# Altium schematic sheet RGMII_PHY.SchDoc
size A3; Organization: Altium Limited; Address1: L3, 12a Rodborough Rd; Address2: Frenchs Forest; Address3: NSW; Address4: Australia 2086; DocumentNumber: 25; SheetNumber: 25; SheetTotal: 54
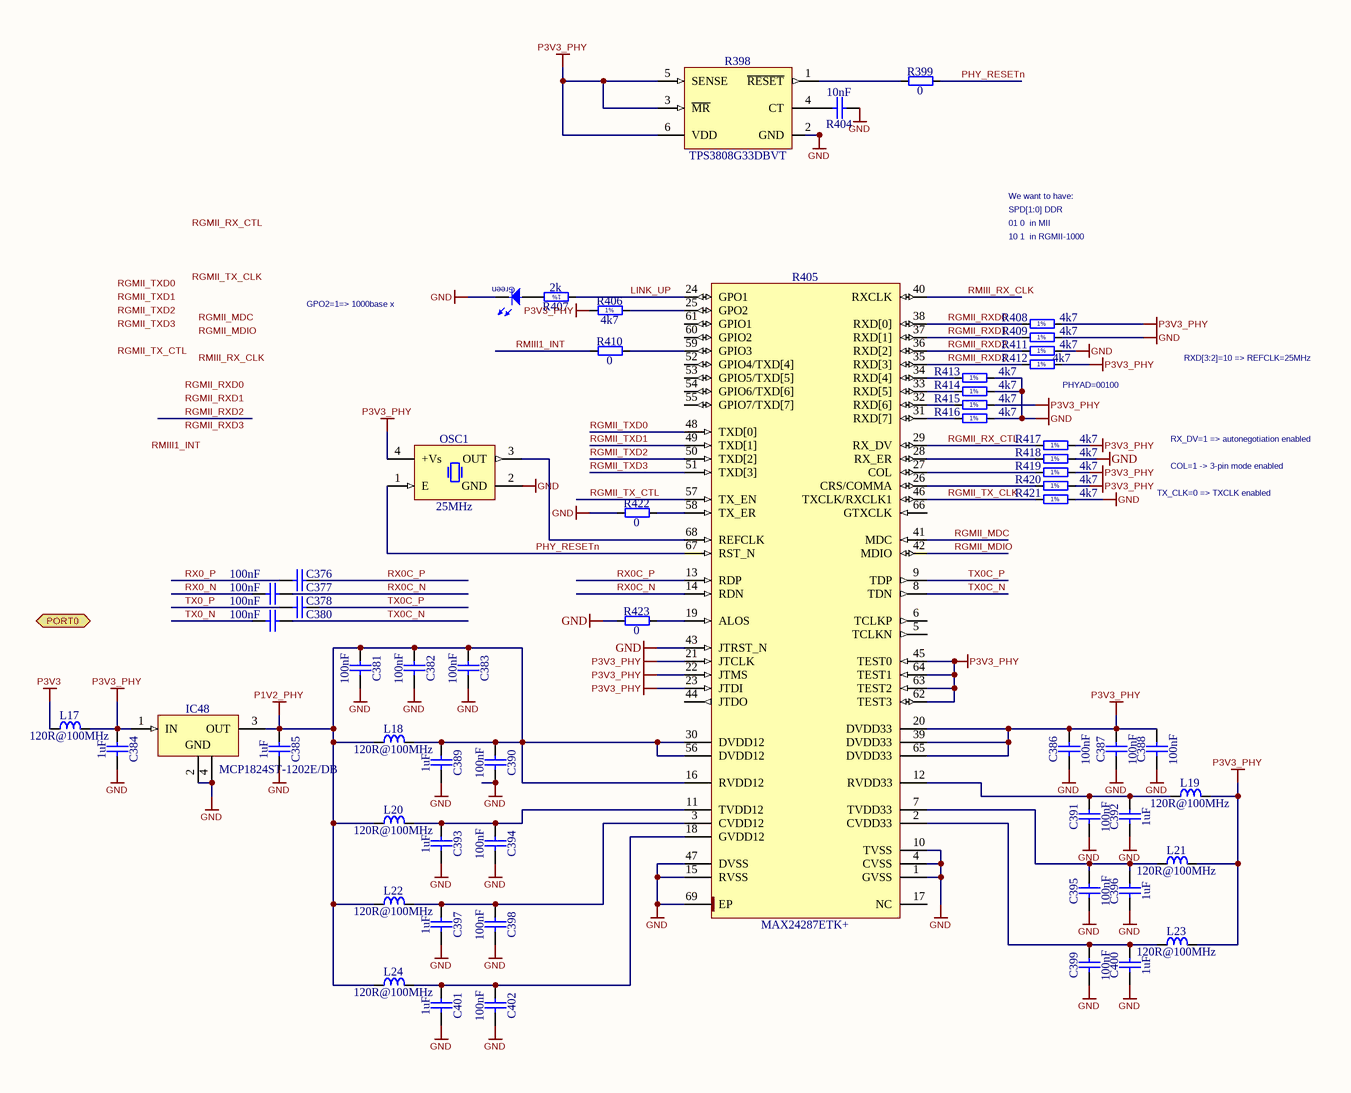
[diagram p0: RGMII_PHY.SchDoc]

## Parts
C376  100nF  [CAPC0603X33N]
C377  100nF  [CAPC0603X33N]
C378  100nF  [CAPC0603X33N]
C380  100nF  [CAPC0603X33N]
C381  100nF  [CAPC0603X33N]
C382  100nF  [CAPC0603X33N]
C383  100nF  [CAPC0603X33N]
C384  1uF  [CAPC1005X55N]
C385  1uF  [CAPC1005X55N]
C386  100nF  [CAPC0603X33N]
C387  100nF  [CAPC0603X33N]
C388  100nF  [CAPC0603X33N]
C389  1uF  [CAPC1005X55N]
C390  100nF  [CAPC0603X33N]
C391  100nF  [CAPC0603X33N]
C392  1uF  [CAPC1005X55N]
C393  1uF  [CAPC1005X55N]
C394  100nF  [CAPC0603X33N]
C395  100nF  [CAPC0603X33N]
C396  1uF  [CAPC1005X55N]
C397  1uF  [CAPC1005X55N]
C398  100nF  [CAPC0603X33N]
C399  100nF  [CAPC0603X33N]
C400  1uF  [CAPC1005X55N]
C401  1uF  [CAPC1005X55N]
C402  100nF  [CAPC0603X33N]
IC48  MCP1824ST-1202E/DB  [SOT230P700X180-4N]
L17  120R@100MHz  [INDC1005X55N]
L18  120R@100MHz  [INDC1005X55N]
L19  120R@100MHz  [INDC1005X55N]
L20  120R@100MHz  [INDC1005X55N]
L21  120R@100MHz  [INDC1005X55N]
L22  120R@100MHz  [INDC1005X55N]
L23  120R@100MHz  [INDC1005X55N]
L24  120R@100MHz  [INDC1005X55N]
LED1  Green  (value not drawn)
OSC1  25MHz  [OSC_IQD_CFPS-73]
R398  TPS3808G33DBVT  [SOT95P280X145-6N]
R399  0  [RESC1005X40N]
R404  10nF  [CAPC1005X55N]
R405  MAX24287ETK+  [QFN40P800X800X80-69N-S635]
R406  4k7  [RESC1005X40N]
R407  2k  [RESC1005X40N]
R408  4k7  [RESC1005X40N]
R409  4k7  [RESC1005X40N]
R410  0  [RESC1005X40N]
R411  4k7  [RESC1005X40N]
R412  4k7  [RESC1005X40N]
R413  4k7  [RESC1005X40N]
R414  4k7  [RESC1005X40N]
R415  4k7  [RESC1005X40N]
R416  4k7  [RESC1005X40N]
R417  4k7  [RESC1005X40N]
R418  4k7  [RESC1005X40N]
R419  4k7  [RESC1005X40N]
R420  4k7  [RESC1005X40N]
R421  4k7  [RESC1005X40N]
R422  0  [RESC1005X40N]
R423  0  [RESC1005X40N]

## Ports
PORT0 (bidir)

## Nets
GND: C381.1 C382.1 C383.1 C384.1 C385.1 C386.1 C387.1 C388.1 C389.1 C390.1 C391.1 C392.1 C393.1 C394.1 C395.1 C396.1 C397.1 C398.1 C399.1 C400.1 C401.1 C402.1 IC48.2(GND) IC48.4(GND) LED1.1(C) OSC1.2(GND) R398.2(GND) R404.1 R405.1(GVSS) R405.4(CVSS) R405.10(TVSS) R405.15(RVSS) R405.43(JTRST_N) R405.47(DVSS) R405.69(EP) R409.2 R411.2 R413.2 R414.2 R416.2 R418.2 R421.2 R422.1 R423.1
P1V2_PHY: C381.2 C382.2 C383.2 C385.2 C389.2 C390.2 IC48.3(OUT) L18.1 L18.2 L20.2 L22.2 L24.2 R405.16(RVDD12) R405.30(DVDD12) R405.56(DVDD12)
P3V3: L17.1
P3V3_PHY: C384.2 C386.2 C387.2 C388.2 IC48.1(IN) L17.2 L19.2 L21.2 L23.2 OSC1.4(+Vs) R398.3(~{MR}) R398.5(SENSE) R398.6(VDD) R405.20(DVDD33) R405.21(JTCLK) R405.22(JTMS) R405.23(JTDI) R405.39(DVDD33) R405.45(TEST0) R405.62(TEST3) R405.63(TEST2) R405.64(TEST1) R405.65(DVDD33) R406.1 R408.2 R412.2 R415.2 R417.2 R419.2 R420.2
LINK_UP: R405.24(GPO1) R407.1
PHY_RESETn: OSC1.1(E) R399.2 R405.67(RST_N)
RGMII_MDC: R405.41(MDC)
RGMII_MDIO: R405.42(MDIO)
RGMII_RX_CTL: R405.29(RX_DV) R417.1
RGMII_RXD0: R405.38(RXD[0]) R408.1
RGMII_RXD1: R405.37(RXD[1]) R409.1
RGMII_RXD2: R405.36(RXD[2]) R411.1
RGMII_RXD3: R405.35(RXD[3]) R412.1
RGMII_TX_CLK: R405.46(TXCLK/RXCLK1) R421.1
RGMII_TX_CTL: R405.57(TX_EN)
RGMII_TXD0: R405.48(TXD[0])
RGMII_TXD1: R405.49(TXD[1])
RGMII_TXD2: R405.50(TXD[2])
RGMII_TXD3: R405.51(TXD[3])
RMIII1_INT: R410.1
RMIII_RX_CLK: R405.40(RXCLK)
RX0_N: C377.1
RX0_P: C376.1
RX0C_N: C377.2 R405.14(RDN)
RX0C_P: C376.2 R405.13(RDP)
TX0_N: C380.1
TX0_P: C378.1
TX0C_N: C380.2 R405.8(TDN)
TX0C_P: C378.2 R405.9(TDP)
NetC391_2: C391.2 C392.2 L19.1 R405.12(RVDD33)
NetC393_2: C393.2 C394.2 L20.1 R405.11(TVDD12)
NetC395_2: C395.2 C396.2 L21.1 R405.7(TVDD33)
NetC397_2: C397.2 C398.2 L22.1 R405.3(CVDD12)
NetC399_2: C399.2 C400.2 L23.1 R405.2(CVDD33)
NetC401_2: C401.2 C402.2 L24.1 R405.18(GVDD12)
NetLED1_2: LED1.2(A) R407.2
NetOSC1_3: OSC1.3(OUT) R405.68(REFCLK)
NetR398_1: R398.1(~{RESET}) R399.1
NetR398_4: R398.4(CT) R404.2
NetR405_19: R405.19(ALOS) R423.2
NetR405_25: R405.25(GPO2) R406.2
NetR405_26: R405.26(CRS/COMMA) R420.1
NetR405_27: R405.27(COL) R419.1
NetR405_28: R405.28(RX_ER) R418.1
NetR405_31: R405.31(RXD[7]) R416.1
NetR405_32: R405.32(RXD[6]) R415.1
NetR405_33: R405.33(RXD[5]) R414.1
NetR405_34: R405.34(RXD[4]) R413.1
NetR405_58: R405.58(TX_ER) R422.2
NetR405_59: R405.59(GPIO3) R410.2

Not connected (* = marked no-connect by the designer): R405 5(TCLKN) 6(TCLKP) 17(NC) 44(JTDO) 52(GPIO4/TXD[4]) 53(GPIO5/TXD[5]) 54(GPIO6/TXD[6]) 55(GPIO7/TXD[7]) 60(GPIO2) 61(GPIO1) 66(GTXCLK)

## Notes on the sheet
- SPD[1:0] DDR
- We want to have:
- 01 0  in MII
- 10 1  in RGMII-1000
- GPO2=1=> 1000base x
- RXD[3:2]=10 => REFCLK=25MHz
- PHYAD=00100
- RX_DV=1 => autonegotiation enabled
- TX_CLK=0 => TXCLK enabled
- COL=1 -> 3-pin mode enabled
- Labels drawn without touching a wire or pin: RGMII_MDC, RGMII_MDIO, RGMII_RX_CTL, RGMII_RXD0, RGMII_RXD1, RGMII_RXD3, RGMII_TX_CLK, RGMII_TX_CTL, RGMII_TXD0, RGMII_TXD1, RGMII_TXD2, RGMII_TXD3, RMIII1_INT, RMIII_RX_CLK
- Title
- Size:
- Date:
- A3
- Number:
- Time:
- Revision:
- Sheet
- of
- File:
- (in symbol R0402_2K_1%_0.0625W_100PPM) 1%
- (in symbol R0402_4K7_1%_0.0625W_100PPM) 1%

## Library data of the parts
C376-C378 C380-C383 C386-C388 C390 C391 C394 C395 C398 C399 C402 = CC0201_100NF_6.3V_10%_X5R: Non-polarised capacitor; Manufacturer: GENERIC; Part Description: SMD Multilayer Chip Ceramic Capacitor; Manufacturer1 Part Number: 02016D104KAT2A; Tolerance: ±10%; Voltage: 6.3V; TC: X5R; Manufacturer Part Number: CC0201_100NF_6.3V_10%_X5R; Part Number: CC0201_100NF_6.3V_10%_X5R; Value: 100nF; Component Kind: Standard; Component Type: Standard; Pin Count: 2; Status: Not Recommended; Case: 0201; Mounted: Yes; Socket: No; SMD: Yes; Sense: No; Manufacturer1 Example: AVX; Manufacturer1 ComponentHeight: 0.33mm; HelpURL: \\cern.ch\dfs\Applications\Altium\Datasheets\CC0201_X5R_AVX.pdf; Author: CERN DEM JLC; CreateDate: 03/12/2007; LatestRevisionDate: 03/12/2007
C384 C385 C389 C392 C393 C396 C397 C400 C401 = CC0402_1UF_16V_10%_X5R: Non-polarised capacitor; Manufacturer: GENERIC; Part Description: SMD Multilayer Chip Ceramic Capacitor; Manufacturer1 Part Number: C1005X5R1C105KT; Tolerance: ±10%; Voltage: 16V; TC: X5R; Manufacturer Part Number: CC0402_1UF_16V_10%_X5R; Part Number: CC0402_1UF_16V_10%_X5R; Value: 1uF; Component Kind: Standard; Component Type: Standard; Pin Count: 2; Status: Preferred; Case: 0402; Mounted: Yes; Socket: No; SMD: Yes; Sense: No; Manufacturer1 Example: TDK; Manufacturer1 ComponentHeight: 0.55mm; HelpURL: \\cern.ch\dfs\Applications\Altium\Datasheets\CC0402_X5R_TDK_C.pdf; Author: CERN DEM JLC; CreateDate: 25/10/2012; LatestRevisionDate: 25/10/2012
IC48 = MCP1824ST-1202E/DB: 3-Terminal Regulator 1=IN 2=GND 3=OUT 4=GND; Manufacturer: MICROCHIP TECHNOLOGY; Part Description: 1.2V 300mA, Low Voltage, Low Quiescent Current LDO Regulator; PressFit: No; Bonding: No; Manufacturer Part Number: MCP1824ST-1202E/DB; PackageDescription: SOT223, 2.30mm pitch; 3 pin, 3.70mm W X 6.70mm L, IPC Medium Density; Part Number: MCP1824ST-1202E/DB; Component Kind: Standard; Component Type: Standard; Device: MCP1824ST-1202E/DB; Pin Count: 4; Case: SOT223; Mounted: Yes; Socket: No; SMD: Yes; Sense: No; ComponentHeight: 1.8mm; HelpURL: \\cern.ch\dfs\Applications\Altium\Datasheets\MCP1824ST-1202E-DB.pdf; Author: CERN DEM JLC; CreateDate: 22/05/2012; LatestRevisionDate: 22/05/2012
L17-L24 = IND0402_MURATA_BLM15PX121SN1D: Inductor; Manufacturer: MURATA; Part Description: SMD EMIFIL Chip Ferrite Bead; Tolerance: ±25%; Power: 2A; Resistance: 0.055R; Manufacturer Part Number: BLM15PX121SN1D; Part Number: IND0402_MURATA_BLM15PX121SN1D; Value: 120R@100MHz; Component Kind: Standard; Component Type: Standard; Pin Count: 2; Status: None; Case: 0402; Mounted: Yes; Socket: No; SMD: Yes; Sense: No; ComponentHeight: 0.55mm; HelpURL: \\cern.ch\dfs\Applications\Altium\Datasheets\IND0402_MURATA_BLM15PX.pdf; Author: CERN DEM JMW; CreateDate: 19/02/2014; LatestRevisionDate: 19/02/2014
LED1 = (no symbol name): Manufacturer Part Number: LG L29K-G2J1-24-Z; Manufacturer: OSRAM; Part Description: Surface Mount Green LED (0603 Case); Part Name: LED_OSRAM_LG L29K-G2J1-24-Z; $$Internal_Resolution: 00001mm; $$NotCommonProperty_Bonding: No; $$NotCommonProperty_Case: 0603; $$NotCommonProperty_Footprint Ref: LED_OSRAM_LGL29K; $$NotCommonProperty_Mounted: Yes; $$NotCommonProperty_Pin Count: 2; $$NotCommonProperty_PressFit: No; CmpIndex: 57; DXDB_LIBNAME: LED_Displays; PressFit: No; Ref Designator: LED?; SymIndex: 383; Table: LEDs & Displays; $$NotCommonProperty_Color: Green; $$NotCommonProperty_ComponentHeight: 0.67mm; $$NotCommonProperty_Sense: No; $$NotCommonProperty_SMD: Yes; $$NotCommonProperty_Socket: No; Author: CERN DEM JLC; Bonding: No; Case: 0603; Cell Name: LED_OSRAM_LGL29K; Color: Green; Component Kind: Standard; Component Type: Standard; ComponentHeight: 0.67mm; CreateDate: 2012-04-24; Footprint: LED_OSRAM_LGL29K; HelpURL: \\cern.ch\dfs\Applications\Altium\Datasheets\LED_OSRAM_LGL29K.pdf; LatestRevisionDate: 2012-04-24; Mounted: Yes; PackageDescription: Green Chip LED, 2-Leads, Body 1.7x0.8mm, IPC Medium Density; Part Number: LED_OSRAM_LG L29K-G2J1-24-Z; Pin Count: 2; SMD: Yes; Socket: No; Orientation: 2 = 2; Comment_1: LED_OSRAM_LG L29K-G2J1-24-Z
OSC1 = OSC_25MHZ_IQD_LFSPXO018077: Oscillator 4 pins 1=E 2=GND 3=OUT 4=+Vs; Part Description: 3.3V, ±50ppm, 50pF, 0..70°C, HCMOS Surface Mount Clock Oscillator (CFPS-73 Series); Manufacturer: IQD FREQUENCY PRODUCTS; PressFit: No; Bonding: No; Part Number: OSC_25MHZ_IQD_LFSPXO018077; Component Kind: Standard; Component Type: Standard; PackageDescription: Oscillator, Side Concave, 5.08mm Pitch, 4 Pins, 5.00mm L X 7.00mm W X 1.40mm H, CFPS-73 Series; Value: 25MHz; Manufacturer Part Number: LFSPXO018077; Pin Count: 4; Mounted: Yes; Socket: No; SMD: Yes; Sense: No; ComponentHeight: 1.4mm; HelpURL: \\cern.ch\dfs\Applications\Altium\Datasheets\OSC_IQD_LFSPXO018077.pdf; Author: CERN DEM JLC; CreateDate: 14/04/2015; LatestRevisionDate: 03/11/2016
R398 = TPS3808G33DBVT: Low Quiescent Current, Programmable-Delay Supervisory Circuit; Manufacturer: TEXAS INSTRUMENTS; Part Description: 3.3V, Low Quiescent Current, Programmable-Delay Supervisory Circuit; PressFit: No; Bonding: No; Manufacturer Part Number: TPS3808G33DBVT; PackageDescription: SOT23, 6-Leads, Body 1.6x3.0mm, Pitch 0.95mm, IPC Medium Density; Part Number: TPS3808G33DBVT; Component Kind: Standard; Component Type: Standard; Device: TPS3808G33DBVT; Pin Count: 6; Case: SOT23-6; Mounted: Yes; Socket: No; SMD: Yes; Sense: No; ComponentHeight: 1.45mm; Author: CERN DEM JLC; HelpURL: \\cern.ch\dfs\Applications\Altium\Datasheets\TPS3808G33DBVT.pdf; CreateDate: 05/11/2013; LatestRevisionDate: 05/11/2013
R399 R410 R422 R423 = R0402_0R_JUMPER: Resistor; Manufacturer: GENERIC; Part Description: 1A (0.05R Max DC Resistance) Zero Ohm Jumper; Manufacturer1 Part Number: 232270591001L; PressFit: No; Manufacturer Part Number: R0402_0R_JUMPER; Part Number: R0402_0R_JUMPER; Value: 0; Component Kind: Standard; Component Type: Standard; Pin Count: 2; Status: Not Recommended; Case: 0402; Mounted: Yes; Sense: No; Socket: No; SMD: Yes; Manufacturer1 Example: YAGEO PHYCOMP; Manufacturer1 ComponentHeight: 0.4mm; HelpURL: \\cern.ch\dfs\Applications\Altium\Datasheets\R0402_Phycomp_RC0402.pdf; Author: CERN DEM JLC; CreateDate: 03/12/2007; LatestRevisionDate: 17/10/2012
R404 = CC0402_10NF_16V_10%_X7R: Non-polarised capacitor; Manufacturer: GENERIC; Part Description: SMD Multilayer Chip Ceramic Capacitor; Manufacturer1 Part Number: 223878715636; Tolerance: ±10%; Voltage: 16V; TC: X7R; Manufacturer Part Number: CC0402_10NF_16V_10%_X7R; Part Number: CC0402_10NF_16V_10%_X7R; Value: 10nF; Component Kind: Standard; Component Type: Standard; Pin Count: 2; Status: Not Recommended; Case: 0402; Mounted: Yes; Socket: No; SMD: Yes; Sense: No; Manufacturer1 Example: PHYCOMP; Manufacturer1 ComponentHeight: 0.55mm; HelpURL: \\cern.ch\dfs\Applications\Altium\Datasheets\CC0402_X7R_PHYCOMP.pdf; Author: CERN DEM JLC; CreateDate: 03/12/2007; LatestRevisionDate: 03/12/2007
R405 = MAX24287ETK+: 1Gbps Parallel-to-Serial MII Converter; Manufacturer: MAXIM; PressFit: No; Bonding: No; Manufacturer Part Number: MAX24287ETK+; PackageDescription: QFN, 0.40mm Pitch, Square; 68 Pin, 8.00mm L X 8.00mm W X 0.80mm H Body (W/Thermal Tab 6.35mm X 6.35mm), IPC Medium Density; Part Description: 1Gbps Parallel-to-Serial MII Converter; Part Number: MAX24287ETK+; Component Kind: Standard; Component Type: Standard; Device: MAX24287ETK+; Status: Not Recommended; Pin Count: 65; Case: QFN64; Mounted: Yes; Socket: No; SMD: Yes; Sense: No; ComponentHeight: 0.8mm; Author: CERN DEM BC; HelpURL: \\cern.ch\dfs\Applications\Altium\Datasheets\MAX24287ETK+.pdf; CreateDate: 16/08/2016; LatestRevisionDate: 30/03/2017
R406 R408 R409 R411-R421 = R0402_4K7_1%_0.0625W_100PPM: Resistor - 1%; Manufacturer: GENERIC; Part Description: General Purpose Thick Film Chip Resistor; Manufacturer1 Part Number: 232270674702L; TC: ±100ppm/°C; PressFit: No; Manufacturer Part Number: R0402_4K7_1%_0.0625W_100PPM; Part Number: R0402_4K7_1%_0.0625W_100PPM; Tolerance: ±1%; Value: 4k7; Component Kind: Standard; Component Type: Standard; Pin Count: 2; Status: Not Recommended; Power: 0.0625W; Case: 0402; Mounted: Yes; Sense: No; Socket: No; SMD: Yes; Manufacturer1 Example: YAGEO PHYCOMP; Manufacturer1 ComponentHeight: 0.4mm; HelpURL: \\cern.ch\dfs\Applications\Altium\Datasheets\R0402_Phycomp_RC0402.pdf; Author: CERN DEM JLC; CreateDate: 03/12/2007; LatestRevisionDate: 17/10/2012
R407 = R0402_2K_1%_0.0625W_100PPM: Resistor - 1%; Manufacturer: GENERIC; Part Description: General Purpose Thick Film Chip Resistor; Manufacturer1 Part Number: 232270672002L; TC: ±100ppm/°C; PressFit: No; Manufacturer Part Number: R0402_2K_1%_0.0625W_100PPM; Part Number: R0402_2K_1%_0.0625W_100PPM; Tolerance: ±1%; Value: 2k; Component Kind: Standard; Component Type: Standard; Pin Count: 2; Status: Not Recommended; Power: 0.0625W; Case: 0402; Mounted: Yes; Sense: No; Socket: No; SMD: Yes; Manufacturer1 Example: YAGEO PHYCOMP; Manufacturer1 ComponentHeight: 0.4mm; HelpURL: \\cern.ch\dfs\Applications\Altium\Datasheets\R0402_Phycomp_RC0402.pdf; Author: CERN DEM JLC; CreateDate: 03/12/2007; LatestRevisionDate: 17/10/2012